# EAGLE design LED_Light_LEDs (EAGLE 6.5.0)
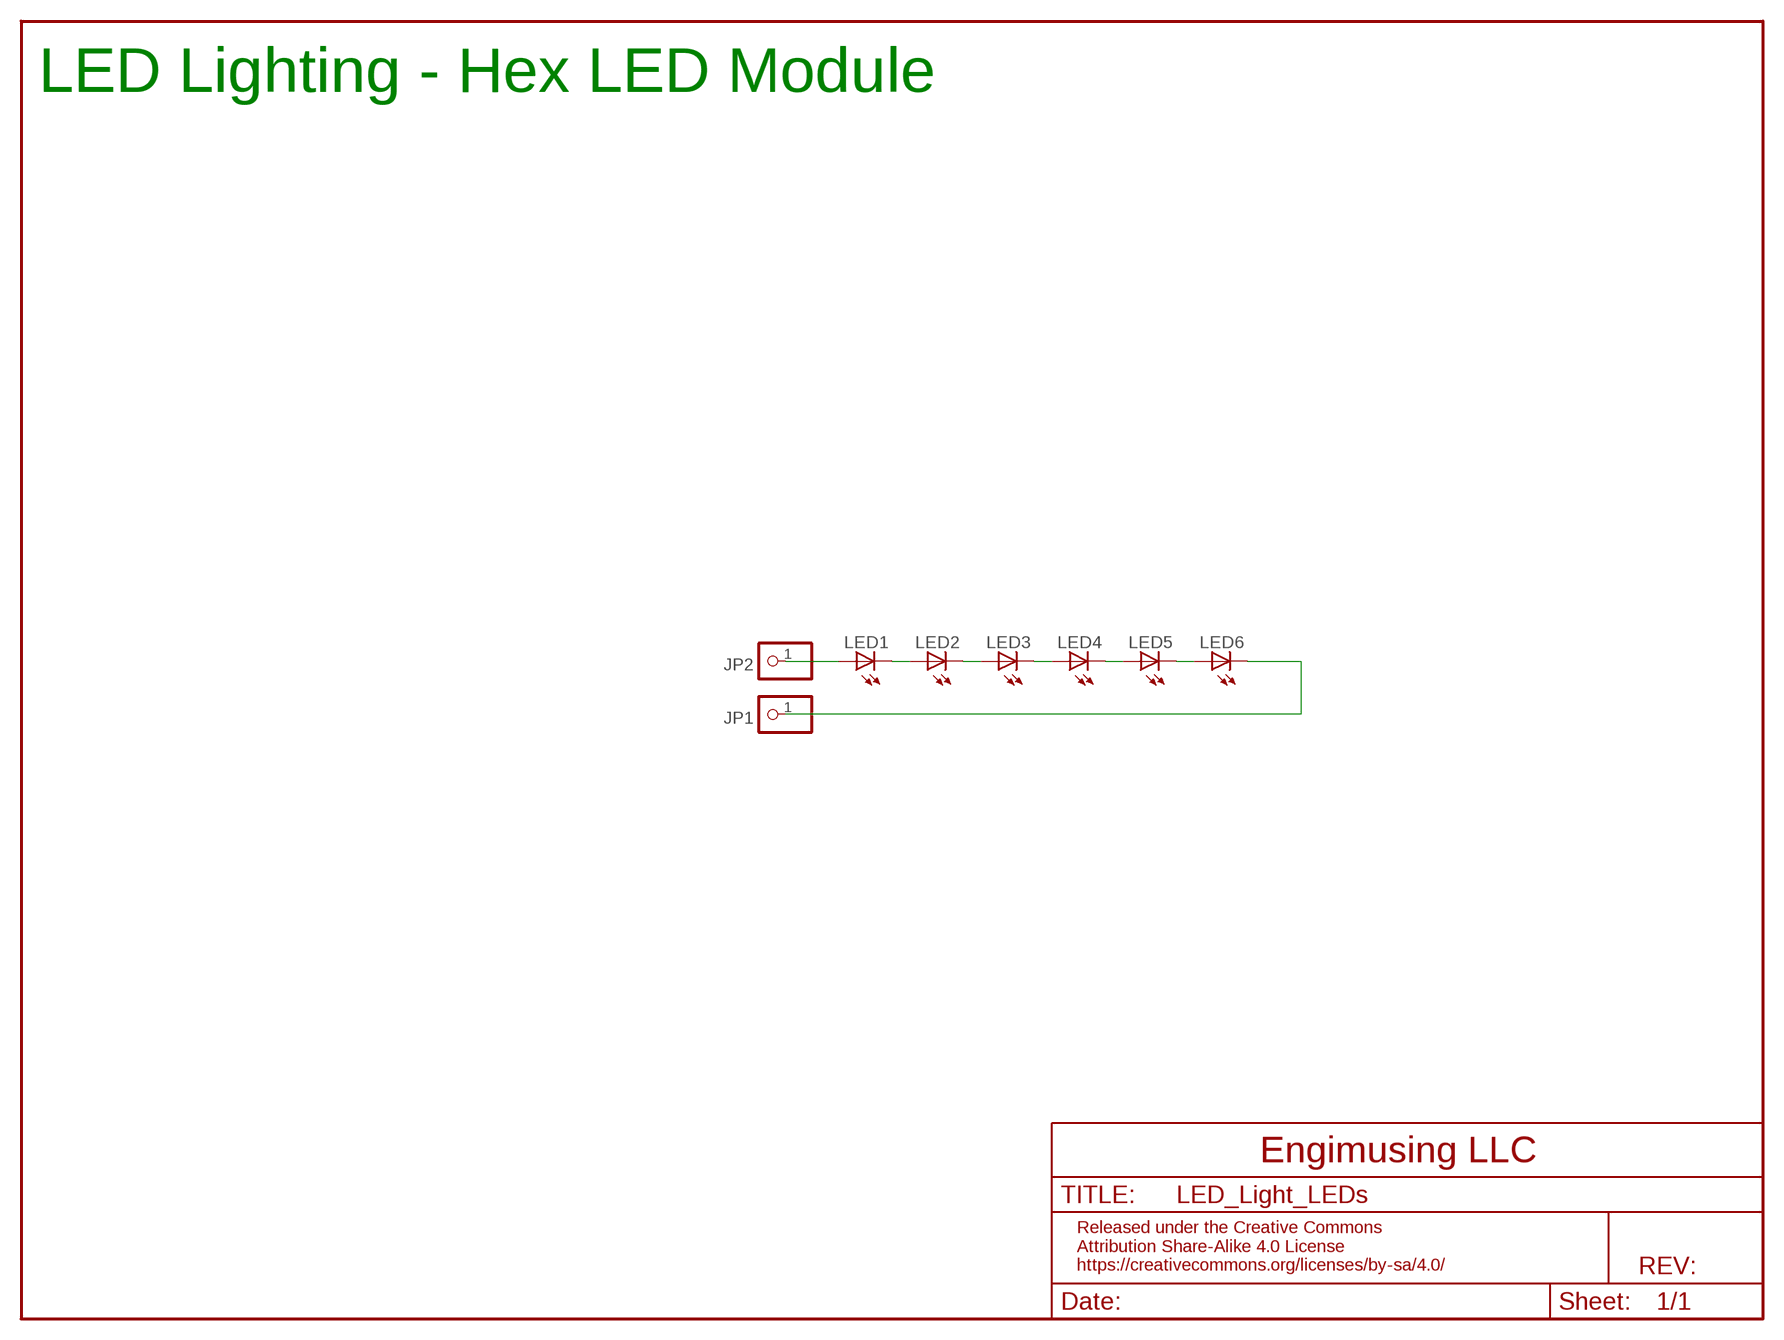
[diagram p0: schematic, sheet 1]

## Parts
JP1  PINHD-1X1  [1X01]
JP2  PINHD-1X1  [1X01]
LED1  LED-MX3  [LED_5X5]
LED2  LED-MX3  [LED_5X5]
LED3  LED-MX3  [LED_5X5]
LED4  LED-MX3  [LED_5X5]
LED5  LED-MX3  [LED_5X5]
LED6  LED-MX3  [LED_5X5]

## Nets
N$1: JP2.1 LED1.A
N$2: JP1.1 LED6.C
N$6: LED1.C LED2.A
N$7: LED2.C LED3.A
N$8: LED3.C LED4.A
N$9: LED4.C LED5.A
N$10: LED5.C LED6.A

## Notes on the sheet
- LED Lighting - Hex LED Module

## Library data of the parts
JP1 JP2 = pinhead:PINHD-1X1: PIN HEADER
LED1-LED6 = Engimusing:LED: LED OSRAM: - CHIPLED LG R971, LG N971, LY N971, LG Q971, LY Q971, LO R971, LY R971 LH N974, LH R974 LS Q976, LO Q976, LY Q976 LO Q996 - Hyper CHIPLED LW Q18S LB Q993, LB Q99A, LB R99A - SideLED LS A670, LO A670, LY A670, LG A670, LP A670 LB A673, LV A673, LT A673, LW A673 LH A674 LY A675 LS A676, LA A676, LO A676, LY A676, LW A676 LS A679, LY A679, LG A679 - Hyper Micro SIDELED® LS Y876, LA Y876, LO Y876, LY Y876 LT Y87S - SmartLED LW L88C, LW L88S LB L89C, LB L89S, LG L890 LS L89K, LO L89K, LY L89K LS L896, LA L896, LO L896, LY L896 - TOPLED LS T670, LO T670, LY T670, LG T670, LP T670 LSG T670, LSP T670, LSY T670, LOP T670, LYG T670 LG T671, LOG T671, LSG T671 LB T673, LV T673, LT T673, LW T673 LH T674 LS T676, LA T676, LO T676, LY T676, LB T676, LH T676, LSB T676, LW T676 LB T67C, LV T67C, LT T67C, LS T67K, LO T67K, LY T67K, LW E67C LS E67B, LA E67B, LO E67B, LY E67B, LB E67C, LV E67C, LT E67C LW T67C LS T679, LY T679, LG T679 LS T770, LO T770, LY T770, LG T770, LP T770 LB T773, LV T773, LT T773, LW T773 LH T774 LS E675, LA E675, LY E675, LS T675 LS T776, LA T776, LO T776, LY T776, LB T776 LHGB T686 LT T68C, LB T68C - Hyper Mini TOPLED® LB M676 - Mini TOPLED Santana® LG M470 LS M47K, LO M47K, LY M47K Source: http://www.osram.convergy.de LUXEON: - LUMILED® LXK2-PW12-R00, LXK2-PW12-S00, LXK2-PW14-U00, LXK2-PW14-V00 LXK2-PM12-R00, LXK2-PM12-S00, LXK2-PM14-U00 LXK2-PE12-Q00, LXK2-PE12-R00, LXK2-PE12-S00, LXK2-PE14-T00, LXK2-PE14-U00 LXK2-PB12-K00, LXK2-PB12-L00, LXK2-PB12-M00, LXK2-PB14-N00, LXK2-PB14-P00, LXK2-PB14-Q00 LXK2-PR12-L00, LXK2-PR12-M00, LXK2-PR14-Q00, LXK2-PR14-R00 LXK2-PD12-Q00, LXK2-PD12-R00, LXK2-PD12-S00 LXK2-PH12-R00, LXK2-PH12-S00 LXK2-PL12-P00, LXK2-PL12-Q00, LXK2-PL12-R00 Source: www.luxeon.com KINGBRIGHT: KA-3528ASYC Source: www.kingbright.com

## Net classes
2 gnd: width 0.254 mm, drill 0.61 mm, clearance 0.254 mm

## Board
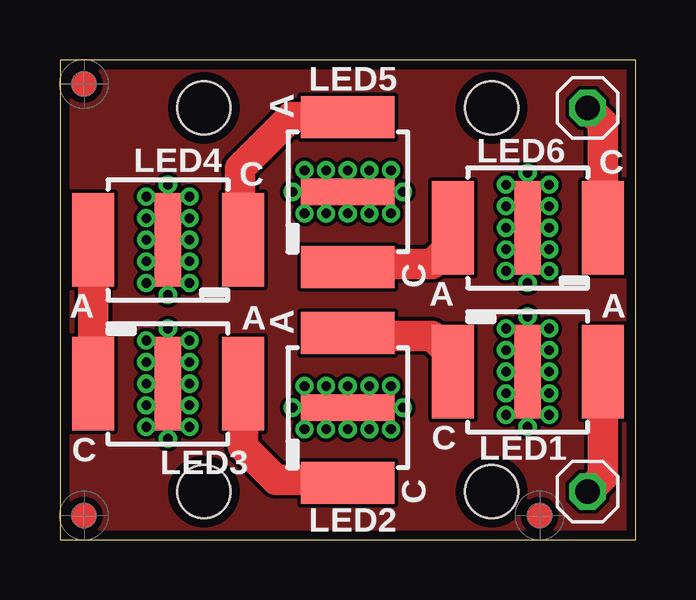
[diagram p1: board, top side]
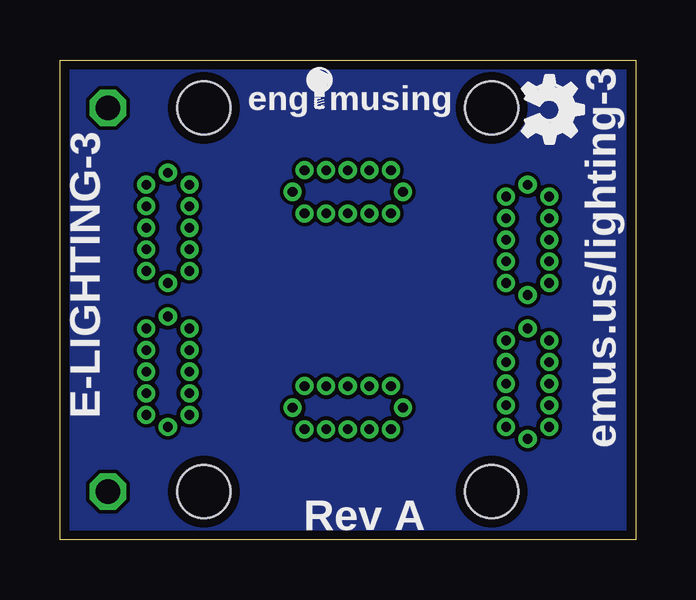
[diagram p2: board, bottom side, seen from below]

Size 24 x 20 mm. Coordinates in mm from the lower left corner, seen from the top.
Outline: 0,20 0,0 24,0 24,20 0,20
Copper layers (1*16): Top 0.0356mm / dielectric 1.5011mm / Bottom 0.0356mm
Design rules "OshPark-2Lyr *": minimum track width 6mil, minimum drill 13mil, track to track 6mil, track to pad 6mil, pad to pad 6mil, via to via 6mil, smd to smd 6mil, copper to edge 15mil, drill to drill 6mil, minimum pad ring 7mil, minimum via ring 7mil, stop-mask expansion 3mil, vias tented up to drill 13mil, thermal gap 10mil
Holes 2.2 mm at 6,18 6,2 18,2 18,18

### Footprints (pad centres in the part's own frame; a part is rotated, then mirrored left to right if it is on the bottom)
1X01 = drill 1.016 octagon: 1 0,0
LED_5X5 = drill 0.4: 1 -0.9,1.8; 2 -0.9,0.9; 3 -0.9,0; 4 -0.9,-0.9; 5 -0.9,-1.8; 6 0.9,1.8; 7 0.9,0.9; 8 0.9,0; 9 0.9,-0.9; 10 0.9,-1.8; 11 0,-2.3; 12 0,2.3 | smd 1.75 x 3.9: A -3.125,0; C 3.125,0 | smd 1.1 x 3.9: P 0,0

### Placement (x,y rotation side)
JP1  22,18 0 top
JP2  22,2 0 top
LED1  19.5,7 180 top
LED2  12,5.5 270 top
LED3  4.5,6.5 180 top
LED4  4.5,12.5 0 top
LED5  12,14.5 270 top
LED6  19.5,13 0 top
U$1  [FIDUCIAL_G10]  1,19 270 top
U$2  [FIDUCIAL_G10]  1,1 270 top
U$3  [OSHW_FILLX100_NOTEXT]  4.71,19.34 270 bottom
U$4  [LOGO]  11.8,18.24 0 bottom
U$5  [FIDUCIAL_G10]  20,1 270 top

### Tracks (layer width: path | path; a pad name or v marks a point on that pad's centre or on a via)
GND
  pour Bottom: 0,20 24,20 24,0 0,0
  pour Top: 0,20 0,0 24,0 24,20
N$1
  Top 1.27: LED1.A 22.62,2.62 JP2.1
N$2
  Top 1.27: LED6.C 22.62,17.38 JP1.1
N$6
  Top 1.27: LED1.C 16.38,7.62 15.5,8.5 13,8.5 LED2.A
N$7
  Top 1.27: LED2.C 11,2.5 9,2.5 7.62,3.88 LED3.A
N$8
  Top 1.27: LED4.A LED3.C
N$9
  Top 1.27: LED5.A 9.62,17.62 7.5,15.5 7.5,14 LED4.C
N$10
  Top 1.27: LED6.A 16.38,12.38 15.5,11.5 13,11.5 LED5.C

### Text on the board
bPlace: emus.us/lighting-3 | E-LIGHTING-3 | Rev A